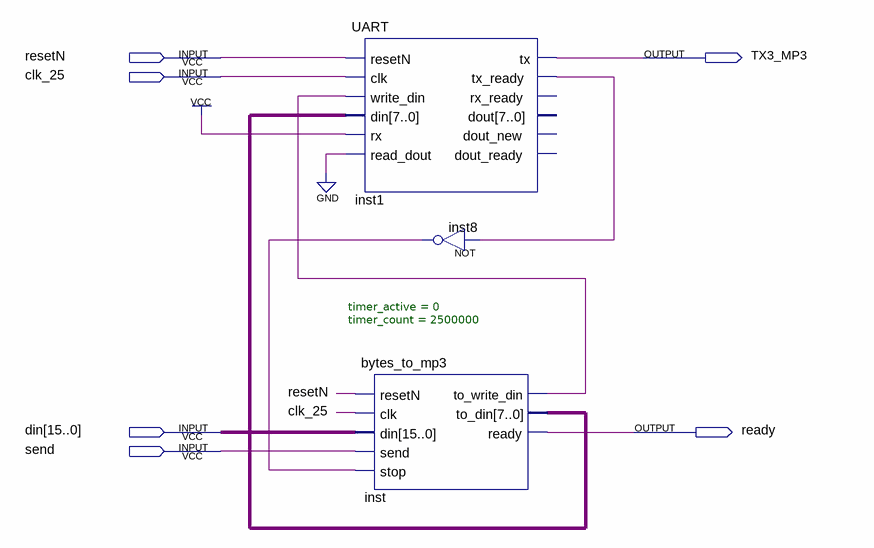
[diagram p0: schematic sheet]
// Quartus schematic mp3_player.bdf as structural Verilog: 3 symbols, 6 pins
module mp3_player (
  input  resetN,
  input  clk_25,
  input  [15:0] din,
  input  send,
  output TX3_MP3,
  output ready
);

  wire inst1_tx_ready, inst8_out, inst_to_write_din;
  wire [7:0] inst_to_din;

  UART inst1 (
    .resetN(resetN), .clk(clk_25), .write_din(inst_to_write_din), .din(inst_to_din), .rx(1'b1),
    .read_dout(1'b0), .tx(TX3_MP3), .tx_ready(inst1_tx_ready));  // open: rx_ready, dout, dout_new, dout_ready
  bytes_to_mp3 #(.timer_active(0), .timer_count(2500000)) inst (
    .resetN(resetN), .clk(clk_25), .din(din), .send(send), .stop(inst8_out),
    .to_write_din(inst_to_write_din), .to_din(inst_to_din), .ready(ready));
  not inst8 (inst8_out, inst1_tx_ready);
endmodule
